# Altium schematic sheet ACCEL_LIS2DH.SchDoc
size A4
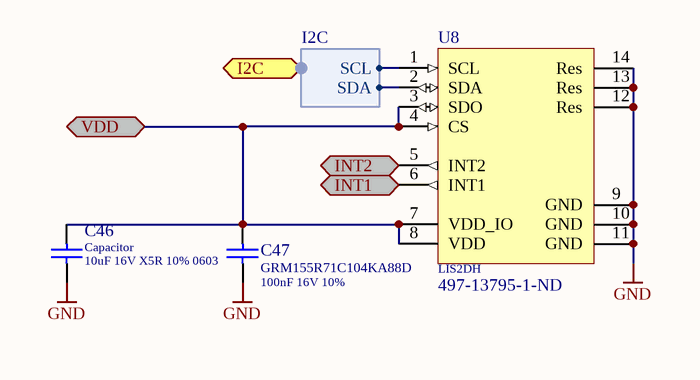
[diagram p0: ACCEL_LIS2DH.SchDoc]

## Parts
C46  Capacitor  value 10uF 16V X5R 10% 0603  [0603]
C47  GRM155R71C104KA88D  value 100nF 16V 10%  [0402]
U8  LIS2DH  Supplier Part Number 1: 497-13795-1-ND  [LGA-14-2x2]

## Ports
I2C (harness I2C), INT1 (out), INT2 (out), VDD

## Harnesses
I2C: SDA, SCL

## Nets
GND: C46.1 C47.2 U8.9(GND) U8.10(GND) U8.11(GND) U8.12(Res) U8.13(Res) U8.14(Res)
INT1: U8.6(INT1) ; port INT1
INT2: U8.5(INT2) ; port INT2
VDD: C46.2 C47.1 U8.3(SDO) U8.4(CS) U8.7(VDD_IO) U8.8(VDD) ; port VDD
NetU8_1: U8.1(SCL) ; port I2C.SCL
NetU8_2: U8.2(SDA) ; port I2C.SDA

## Library data of the parts
C46 = Capacitor ceramic: Ceramic capacitor; Voltage: 16V; Tolerance: 10%; Capacitance: 10uF; Dielectric: X5R
C47 = Capacitor ceramic: Ceramic capacitor; Voltage: 16V; Tolerance: 10%; Capacitance: 100nF
U8 = LIS2DH: MEMS digital output motion sensor: ultra low-power high performance 3-axis “femto” accelerometer; Datasheet: http://www.st.com/st-web-ui/static/active/en/resource/technical/document/datasheet/DM00042751.pdf; Supplier: http://www.compel.ru/infosheet/ST/LIS2DHTR; Supplier 1: Digi-Key